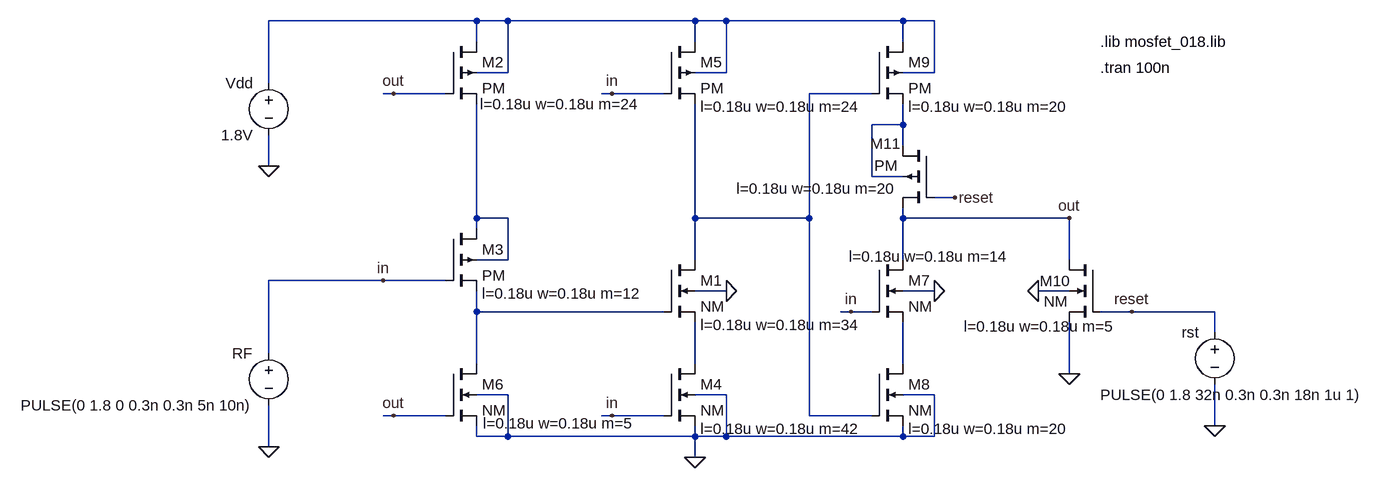
[diagram p0: schematic div_by_two.asc]
div_by_two.asc, the LTspice schematic file:
Version 4
SHEET 1 1256 680
WIRE -112 -80 -432 -80
WIRE -64 -80 -112 -80
WIRE 224 -80 -64 -80
WIRE 272 -80 224 -80
WIRE 544 -80 272 -80
WIRE 592 -80 544 -80
WIRE -112 -48 -112 -80
WIRE 224 -48 224 -80
WIRE 544 -48 544 -80
WIRE -64 0 -64 -80
WIRE -64 0 -112 0
WIRE 272 0 272 -80
WIRE 272 0 224 0
WIRE 592 0 592 -80
WIRE 592 0 544 0
WIRE -432 16 -432 -80
WIRE -240 32 -256 32
WIRE -160 32 -240 32
WIRE 96 32 80 32
WIRE 176 32 96 32
WIRE 496 32 400 32
WIRE 544 80 544 48
WIRE 544 80 496 80
WIRE 544 112 544 80
WIRE -432 144 -432 96
WIRE 496 160 496 80
WIRE 544 160 496 160
WIRE 624 192 592 192
WIRE -112 224 -112 48
WIRE -64 224 -112 224
WIRE 224 224 224 48
WIRE 400 224 400 32
WIRE 400 224 224 224
WIRE 544 224 544 208
WIRE 800 224 544 224
WIRE -112 240 -112 224
WIRE -64 288 -64 224
WIRE -64 288 -112 288
WIRE 224 288 224 224
WIRE 544 288 544 224
WIRE 800 288 800 224
WIRE -256 320 -432 320
WIRE -160 320 -256 320
WIRE 272 336 224 336
WIRE 592 336 544 336
WIRE 800 336 752 336
WIRE -112 368 -112 336
WIRE 176 368 -112 368
WIRE 464 368 448 368
WIRE 496 368 464 368
WIRE 896 368 848 368
WIRE 1024 368 896 368
WIRE 1024 400 1024 368
WIRE -432 432 -432 320
WIRE -112 448 -112 368
WIRE 224 448 224 384
WIRE 544 448 544 384
WIRE 800 464 800 384
WIRE -64 496 -112 496
WIRE 272 496 224 496
WIRE 592 496 544 496
WIRE -240 528 -256 528
WIRE -160 528 -240 528
WIRE 96 528 80 528
WIRE 176 528 96 528
WIRE 400 528 400 224
WIRE 496 528 400 528
WIRE 1024 544 1024 480
WIRE -112 560 -112 544
WIRE -64 560 -64 496
WIRE -64 560 -112 560
WIRE 224 560 224 544
WIRE 224 560 -64 560
WIRE 272 560 272 496
WIRE 272 560 224 560
WIRE 544 560 544 544
WIRE 544 560 272 560
WIRE 592 560 592 496
WIRE 592 560 544 560
WIRE -432 576 -432 512
WIRE 224 592 224 560
FLAG 272 336 0
FLAG 592 336 0
FLAG 752 336 0
FLAG 800 224 out
FLAG -240 32 out
FLAG -240 528 out
FLAG 464 368 in
FLAG 896 368 reset
FLAG 224 592 0
FLAG -256 320 in
FLAG -432 576 0
FLAG -432 144 0
FLAG 96 32 in
FLAG 96 528 in
FLAG 1024 544 0
FLAG 800 464 0
FLAG 624 192 reset
SYMBOL nmos4 176 288 R0
WINDOW 123 56 100 Left 2
SYMATTR Value2 l=0.18u w=0.18u m=34
SYMATTR InstName M1
SYMATTR Value NM
SYMBOL pmos4 -160 -48 R0
WINDOW 123 53 96 Left 2
SYMATTR Value2 l=0.18u w=0.18u m=24
SYMATTR InstName M2
SYMATTR Value PM
SYMBOL pmos4 -160 240 R0
WINDOW 123 56 100 Left 2
SYMATTR Value2 l=0.18u w=0.18u m=12
SYMATTR InstName M3
SYMATTR Value PM
SYMBOL nmos4 176 448 R0
WINDOW 123 56 100 Left 2
SYMATTR Value2 l=0.18u w=0.18u m=42
SYMATTR InstName M4
SYMATTR Value NM
SYMBOL pmos4 176 -48 R0
WINDOW 123 56 100 Left 2
SYMATTR Value2 l=0.18u w=0.18u m=24
SYMATTR InstName M5
SYMATTR Value PM
SYMBOL nmos4 -160 448 R0
WINDOW 123 58 92 Left 2
SYMATTR Value2 l=0.18u w=0.18u m=5
SYMATTR InstName M6
SYMATTR Value NM
SYMBOL nmos4 496 288 R0
WINDOW 123 -35 -5 Left 2
SYMATTR Value2 l=0.18u w=0.18u m=14
SYMATTR InstName M7
SYMATTR Value NM
SYMBOL nmos4 496 448 R0
WINDOW 123 56 100 Left 2
SYMATTR Value2 l=0.18u w=0.18u m=20
SYMATTR InstName M8
SYMATTR Value NM
SYMBOL pmos4 496 -48 R0
WINDOW 123 56 100 Left 2
SYMATTR Value2 l=0.18u w=0.18u m=20
SYMATTR InstName M9
SYMATTR Value PM
SYMBOL nmos4 848 288 M0
WINDOW 0 46 33 Left 2
WINDOW 3 50 64 Left 2
WINDOW 123 -24 103 Left 2
SYMATTR InstName M10
SYMATTR Value NM
SYMATTR Value2 l=0.18u w=0.18u m=5
SYMBOL voltage -432 416 M0
WINDOW 123 0 0 Left 2
WINDOW 39 0 0 Left 2
SYMATTR InstName RF
SYMATTR Value PULSE(0 1.8 0 0.3n 0.3n 5n 10n)
SYMBOL voltage -432 0 M0
SYMATTR InstName Vdd
SYMATTR Value 1.8V
SYMBOL voltage 1024 384 M0
WINDOW 123 0 0 Left 2
WINDOW 39 0 0 Left 2
WINDOW 3 -229 112 Left 2
SYMATTR Value PULSE(0 1.8 32n 0.3n 0.3n 18n 1u 1)
SYMATTR InstName rst
SYMBOL pmos4 592 112 M0
WINDOW 123 57 66 Left 2
WINDOW 0 51 -3 Left 2
WINDOW 3 56 31 Left 2
SYMATTR Value2 l=0.18u w=0.18u m=20
SYMATTR InstName M11
SYMATTR Value PM
TEXT 848 -48 Left 2 !.lib mosfet_018.lib
TEXT 848 -8 Left 2 !.tran 100n

The netlist it stands for:
* div_by_two.asc
M1 N002 N005 N006 0 NM l=0.18u w=0.18u m=34
M2 N001 out N004 N001 PM l=0.18u w=0.18u m=24
M3 N004 in N005 N004 PM l=0.18u w=0.18u m=12
M4 N006 in 0 0 NM l=0.18u w=0.18u m=42
M5 N001 in N002 N001 PM l=0.18u w=0.18u m=24
M6 N005 out 0 0 NM l=0.18u w=0.18u m=5
M7 out in N007 0 NM l=0.18u w=0.18u m=14
M8 N007 N002 0 0 NM l=0.18u w=0.18u m=20
M9 N001 N002 N003 N001 PM l=0.18u w=0.18u m=20
M10 out reset 0 0 NM l=0.18u w=0.18u m=5
V§RF in 0 PULSE(0 1.8 0 0.3n 0.3n 5n 10n)
Vdd N001 0 1.8V
V§rst reset 0 PULSE(0 1.8 32n 0.3n 0.3n 18n 1u 1)
M11 N003 reset out N003 PM l=0.18u w=0.18u m=20
.model NMOS NMOS
.model PMOS PMOS
.lib standard.mos
.lib mosfet_018.lib
.tran 100n
.backanno
.end